# Altium schematic sheet Main.SchDoc
size A4; SheetNumber: 1; SheetTotal: 6
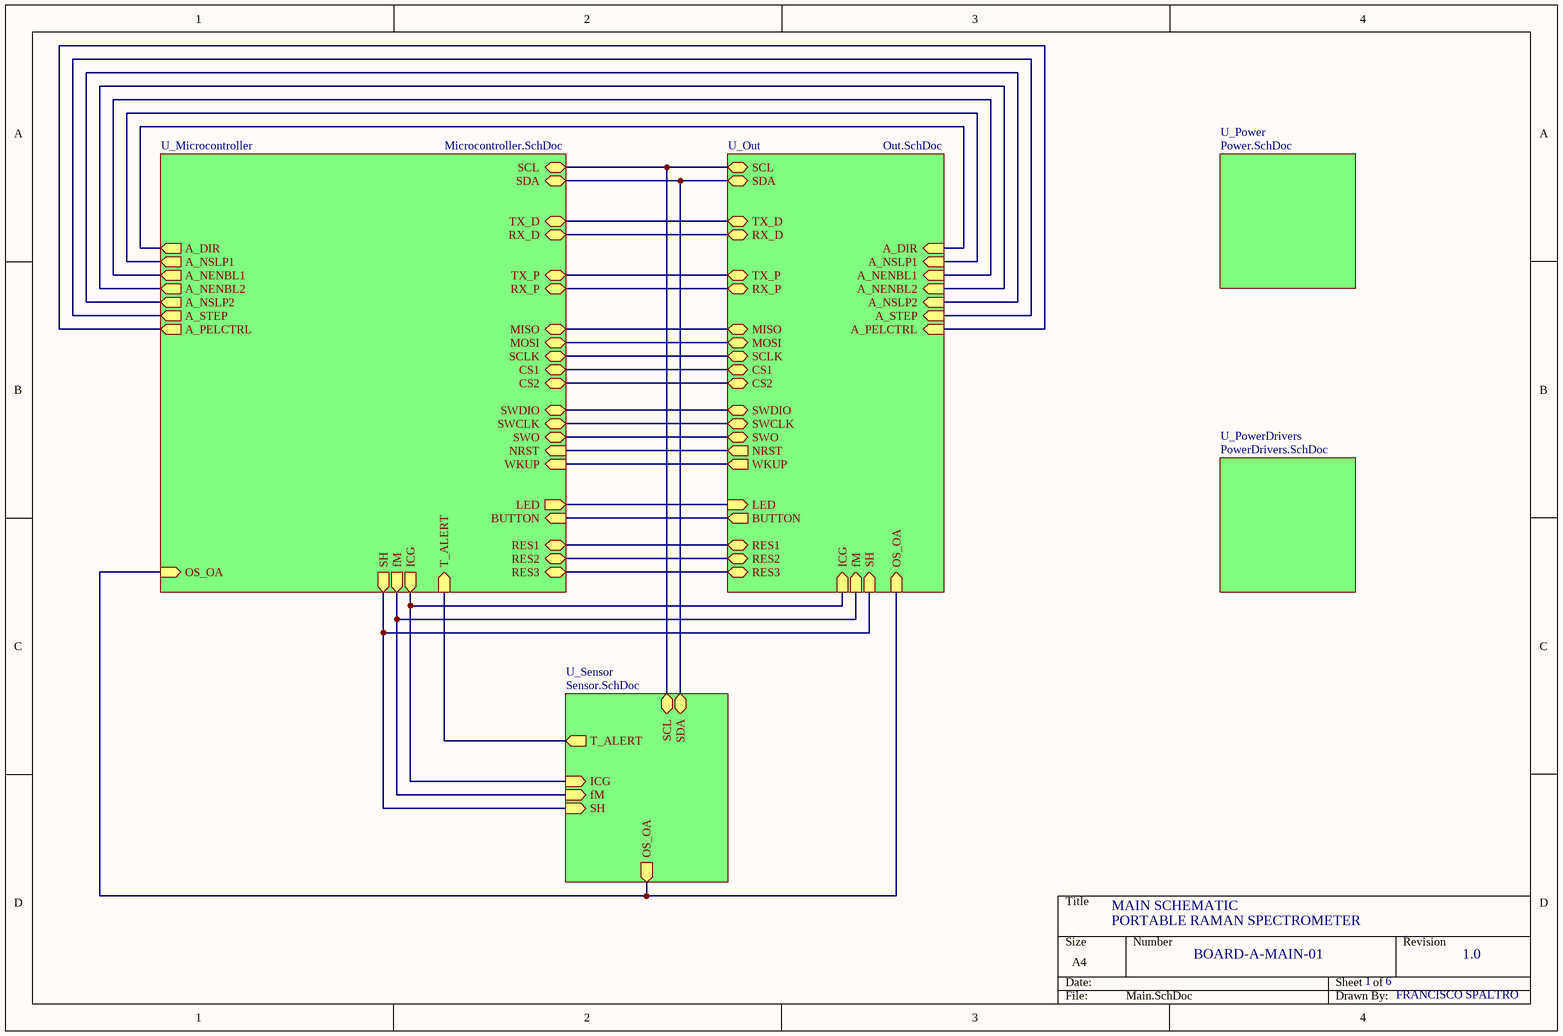
[diagram p0: Main.SchDoc]

## Sub-sheets
U_Microcontroller = Microcontroller.SchDoc: SCL (bidir), TX_P (bidir), RX_P (bidir), SWDIO (bidir), SWCLK (bidir), TX_D (bidir), RX_D (bidir), SDA (bidir), SCLK (bidir), MISO (bidir), MOSI (bidir), SH (out), fM (out), ICG (out), LED (out), BUTTON (in), RES1 (bidir), RES2 (bidir), WKUP (in), CS1 (bidir), SWO (bidir), NRST (in), CS2 (bidir), T_ALERT (in), A_DIR (out), A_NSLP1 (out), A_NENBL1 (out), A_NENBL2 (out), A_NSLP2 (out), A_STEP (out), A_PELCTRL (out), RES3 (bidir), OS_OA (in)
U_Out = Out.SchDoc: TX_P (bidir), RX_P (bidir), TX_D (bidir), RX_D (bidir), MISO (bidir), MOSI (bidir), SCL (bidir), SDA (bidir), SCLK (bidir), SH (in), fM (in), ICG (in), SWDIO (bidir), SWCLK (bidir), RES1 (bidir), RES2 (bidir), LED (in), BUTTON (out), WKUP (out), CS1 (bidir), CS2 (bidir), NRST (out), SWO (bidir), A_DIR (in), A_NSLP1 (in), A_NENBL1 (in), A_STEP (in), A_NENBL2 (in), A_NSLP2 (in), A_PELCTRL (in), RES3 (bidir), OS_OA (in)
U_Power = Power.SchDoc: no entries
U_PowerDrivers = PowerDrivers.SchDoc: no entries
U_Sensor = Sensor.SchDoc: ICG (in), fM (in), SH (in), SCL (bidir), SDA (bidir), T_ALERT (out), OS_OA (out)

## Nets
(unnamed): sheet U_Out/TX_P, sheet U_Microcontroller/TX_P
(unnamed): sheet U_Out/RX_P, sheet U_Microcontroller/RX_P
(unnamed): sheet U_Out/TX_D, sheet U_Microcontroller/TX_D
(unnamed): sheet U_Out/RX_D, sheet U_Microcontroller/RX_D
(unnamed): sheet U_Out/MISO, sheet U_Microcontroller/MISO
(unnamed): sheet U_Out/MOSI, sheet U_Microcontroller/MOSI
(unnamed): sheet U_Out/SCL, sheet U_Sensor/SCL, sheet U_Microcontroller/SCL
(unnamed): sheet U_Out/SDA, sheet U_Sensor/SDA, sheet U_Microcontroller/SDA
(unnamed): sheet U_Out/SCLK, sheet U_Microcontroller/SCLK
(unnamed): sheet U_Out/SH, sheet U_Sensor/SH, sheet U_Microcontroller/SH
(unnamed): sheet U_Out/fM, sheet U_Sensor/fM, sheet U_Microcontroller/fM
(unnamed): sheet U_Out/ICG, sheet U_Sensor/ICG, sheet U_Microcontroller/ICG
(unnamed): sheet U_Out/SWDIO, sheet U_Microcontroller/SWDIO
(unnamed): sheet U_Out/SWCLK, sheet U_Microcontroller/SWCLK
(unnamed): sheet U_Out/RES1, sheet U_Microcontroller/RES1
(unnamed): sheet U_Out/RES2, sheet U_Microcontroller/RES2
(unnamed): sheet U_Out/LED, sheet U_Microcontroller/LED
(unnamed): sheet U_Out/BUTTON, sheet U_Microcontroller/BUTTON
(unnamed): sheet U_Out/WKUP, sheet U_Microcontroller/WKUP
(unnamed): sheet U_Out/CS1, sheet U_Microcontroller/CS1
(unnamed): sheet U_Out/CS2, sheet U_Microcontroller/CS2
(unnamed): sheet U_Out/NRST, sheet U_Microcontroller/NRST
(unnamed): sheet U_Out/SWO, sheet U_Microcontroller/SWO
(unnamed): sheet U_Out/A_DIR, sheet U_Microcontroller/A_DIR
(unnamed): sheet U_Out/A_NSLP1, sheet U_Microcontroller/A_NSLP1
(unnamed): sheet U_Out/A_NENBL1, sheet U_Microcontroller/A_NENBL1
(unnamed): sheet U_Out/A_STEP, sheet U_Microcontroller/A_STEP
(unnamed): sheet U_Out/A_NENBL2, sheet U_Microcontroller/A_NENBL2
(unnamed): sheet U_Out/A_NSLP2, sheet U_Microcontroller/A_NSLP2
(unnamed): sheet U_Out/A_PELCTRL, sheet U_Microcontroller/A_PELCTRL
(unnamed): sheet U_Out/RES3, sheet U_Microcontroller/RES3
(unnamed): sheet U_Out/OS_OA, sheet U_Sensor/OS_OA, sheet U_Microcontroller/OS_OA
(unnamed): sheet U_Sensor/T_ALERT, sheet U_Microcontroller/T_ALERT

## Notes on the sheet
- MAIN SCHEMATIC
- PORTABLE RAMAN SPECTROMETER
- BOARD-A-MAIN-01
- 1
- 6
- 1.0
- FRANCISCO SPALTRO